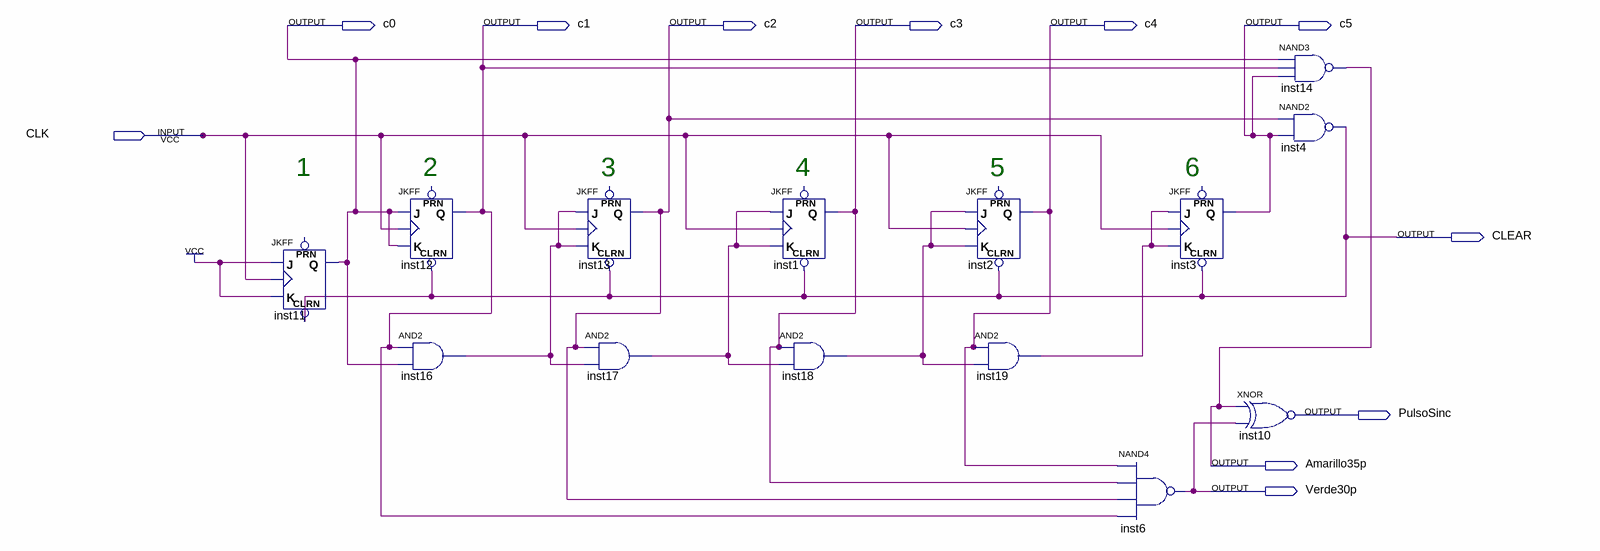
[diagram p0: schematic sheet]
// Quartus schematic Tp2Grupo3_Contador35.bdf as structural Verilog: 14 symbols, 11 pins
module Tp2Grupo3_Contador35 (
  input  CLK,
  output c0,
  output c1,
  output c2,
  output c3,
  output c4,
  output c5,
  output CLEAR,
  output PulsoSinc,
  output Amarillo35p,
  output Verde30p
);

  wire inst16_out, inst17_out, inst18_out, inst19_out;

  JKFF inst11 (.CLRN(CLEAR), .K(1'b1), .J(1'b1), .CLK(CLK), .Q(c0));  // open: PRN
  JKFF inst12 (.CLRN(CLEAR), .K(c0), .J(c0), .CLK(CLK), .Q(c1));  // open: PRN
  and inst16 (inst16_out, c1, c0);
  JKFF inst13 (.CLRN(CLEAR), .K(inst16_out), .J(inst16_out), .CLK(CLK), .Q(c2));  // open: PRN
  and inst17 (inst17_out, c2, inst16_out);
  JKFF inst1 (.CLRN(CLEAR), .K(inst17_out), .J(inst17_out), .CLK(CLK), .Q(c3));  // open: PRN
  and inst18 (inst18_out, c3, inst17_out);
  JKFF inst2 (.CLRN(CLEAR), .K(inst18_out), .J(inst18_out), .CLK(CLK), .Q(c4));  // open: PRN
  and inst19 (inst19_out, c4, inst18_out);
  JKFF inst3 (.CLRN(CLEAR), .K(inst19_out), .J(inst19_out), .CLK(CLK), .Q(c5));  // open: PRN
  nand inst6 (Verde30p, c4, c3, c2, c1);
  xnor inst10 (PulsoSinc, Amarillo35p, Verde30p);
  nand inst14 (Amarillo35p, c0, c1, c5);
  nand inst4 (CLEAR, c2, c5);

  // Notes on the sheet:
  //   1
  //   2
  //   3
  //   4
  //   5
  //   6
endmodule
